# Altium schematic sheet Schematic3.SchDoc
size A4
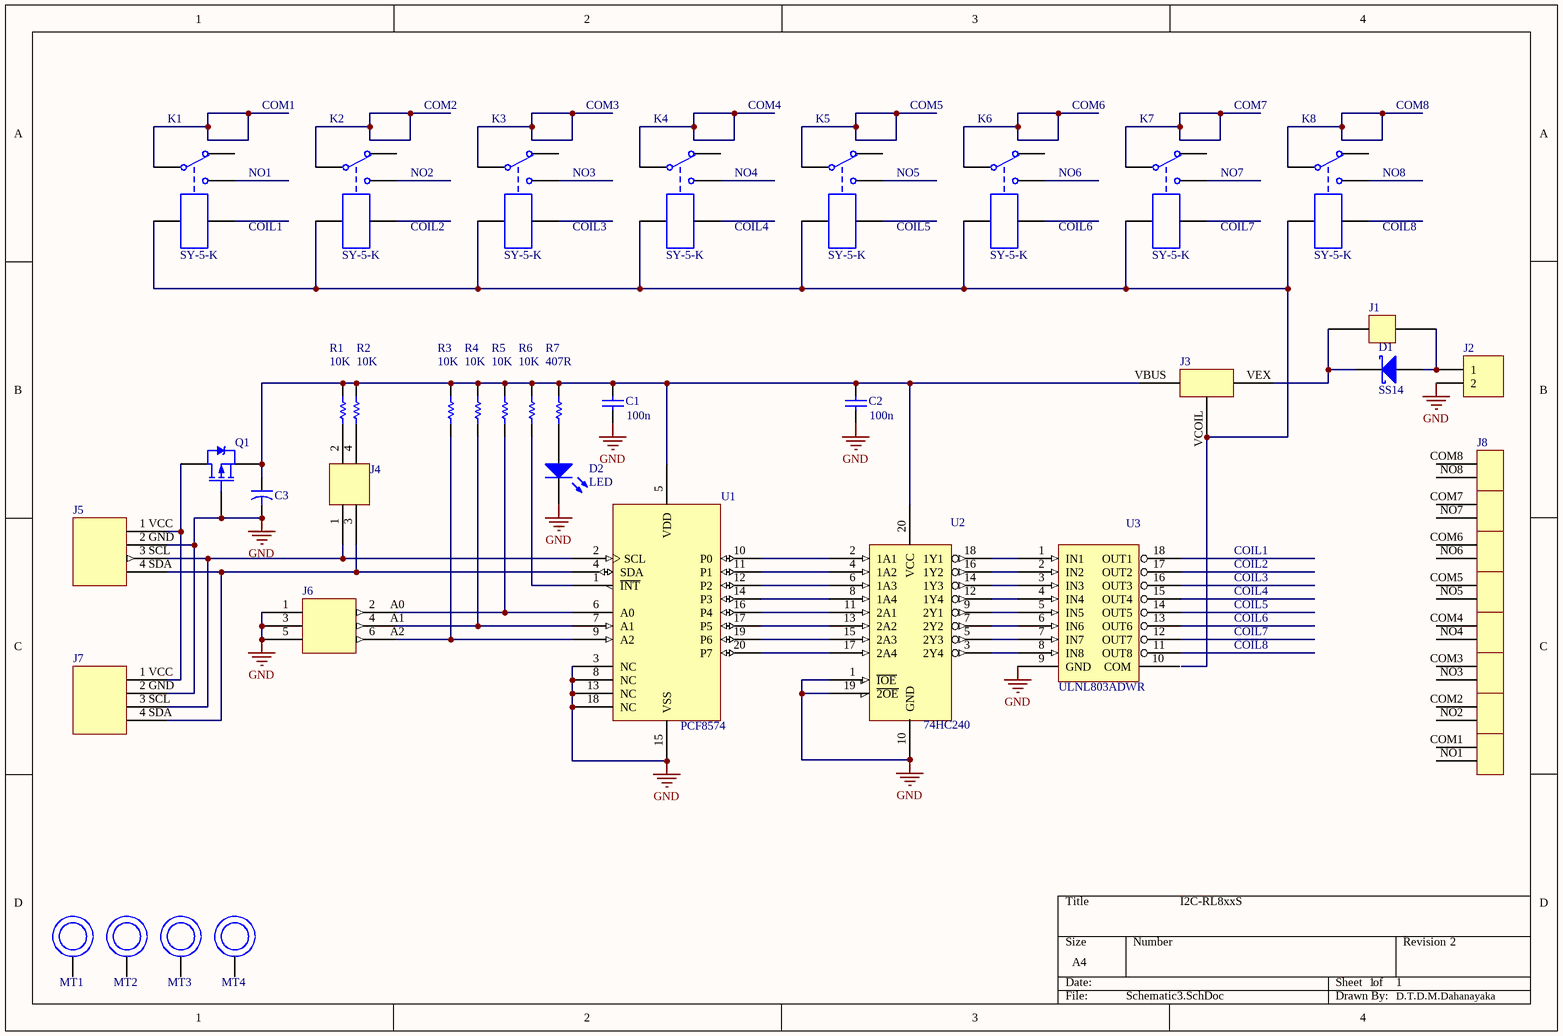
[diagram p0: Schematic3.SchDoc]

## Parts
1  SY-5-K  [MODULE5B]
2  SY-5-K  [MODULE5B]
3  SY-5-K  [MODULE5B]
4  SY-5-K  [MODULE5B]
5  SY-5-K  [MODULE5B]
6  SY-5-K  [MODULE5B]
7  SY-5-K  [MODULE5B]
8  SY-5-K  [MODULE5B]
C1  value 100n  [RAD-0.3]  (hidden comment: Cap)
C2  value 100n  [RAD-0.3]  (hidden comment: Cap)
C3  Cap2  [CAPR5-4X5]  (value not drawn)
D1  SS14  [TO-220AC]
D2  LED  [LED-0]
J1  Component_1  (value not drawn)
J2  (no value)  [HDR1X2]
J3  Component_1  (value not drawn)
J4  Component_1  (value not drawn)
J5  Component_1  (value not drawn)
J6  Component_1  (value not drawn)
J7  Component_1  (value not drawn)
J8  Component_1  (value not drawn)
MT1  Component_1  (value not drawn)
MT2  (no value)
MT3  (no value)
MT4  (no value)
Q1  PMOS-2  [TO-220AB]  (value not drawn)
R1  value 10K  [AXIAL-0.3]
R2  value 10K  [AXIAL-0.3]
R3  value 10K  [AXIAL-0.3]  (hidden comment: Res1)
R4  value 10K  [AXIAL-0.3]  (hidden comment: Res1)
R5  value 10K  [AXIAL-0.3]  (hidden comment: Res1)
R6  value 10K  [AXIAL-0.3]  (hidden comment: Res1)
R7  value 407R  [AXIAL-0.3]  (hidden comment: Res1)
U1  PCF8574
U2  74HC240
U3  ULNL803ADWR

## Nets
GND: C1.1 C2.1 C3.2 D2.2(K) J2.?2(2) J5.2_GND J6.1 J6.3 J6.5 J7.2_GND Q1.1(G) U1.3(NC) U1.8(NC) U1.13(NC) U1.15(VSS) U1.18(NC) U2.1(~{IOE}) U2.10(GND) U2.19(~{2OE}) U3.9(GND)
Net1_4: 1.4 2.4 3.4 4.4 5.4 6.4 7.4 8.4 J3.VCOIL
NetC1_2: C1.2 C2.2 C3.1 J3.VBUS Q1.3(S) R1.2 R2.2 R3.2 R4.2 R5.2 R6.2 R7.2 U1.5(VDD) U2.20(VCC)
NetD1_1: D1.1(K) J1.?1 J3.VEX
NetD1_3: D1.3(A) J1.?2 J2.?1(1)
NetD2_1: D2.1(A) R7.1
NetJ4_1: J4.1 J5.3_SCL J7.3_SCL U1.2(SCL)
NetJ4_3: J4.3 J5.4_SDA J7.4_SDA U1.4(SDA)
NetJ5_1 VCC: J5.1_VCC J7.1_VCC Q1.2(D)
NetJ6_2     A0: J6.2_A0 R5.1 U1.6(A0)
NetJ6_4     A1: J6.4_A1 R4.1 U1.7(A1)
NetJ6_6     A2: J6.6_A2 R3.1 U1.9(A2)
NetR6_1: R6.1 U1.1(~{INT})
NetU1_10: U1.10(P0) U2.2(1A1)
NetU1_11: U1.11(P1) U2.4(1A2)
NetU1_12: U1.12(P2) U2.6(1A3)
NetU1_14: U1.14(P3) U2.8(1A4)
NetU1_16: U1.16(P4) U2.11(2A1)
NetU1_17: U1.17(P5) U2.13(2A2)
NetU1_19: U1.19(P6) U2.15(2A3)
NetU1_20: U1.20(P7) U2.17(2A4)
NetU2_3: U2.3(2Y4) U3.8(IN8)
NetU2_5: U2.5(2Y3) U3.7(IN7)
NetU2_7: U2.7(2Y2) U3.6(IN6)
NetU2_9: U2.9(2Y1) U3.5(IN5)
NetU2_12: U2.12(1Y4) U3.4(IN4)
NetU2_14: U2.14(1Y3) U3.3(IN3)
NetU2_16: U2.16(1Y2) U3.2(IN2)
NetU2_18: U2.18(1Y1) U3.1(IN1)

Not connected (* = marked no-connect by the designer): 1 1 2 3 5; 2 1 2 3 5; 3 1 2 3 5; 4 1 2 3 5; 5 1 2 3 5; 6 1 2 3 5; 7 1 2 3 5; 8 1 2 3 5; J4 2 4; J8 COM1 COM2 COM3 COM4 COM5 COM6 COM7 COM8 NO1 NO2 NO3 NO4 NO5 NO6 NO7 NO8; MT1 ?1; MT2 ?1; MT3 ?1; MT4 ?1; R1 1; R2 1; U3 10(COM) 11(OUT8) 12(OUT7) 13(OUT6) 14(OUT5) 15(OUT4) 16(OUT3) 17(OUT2) 18(OUT1)

## Notes on the sheet
- COM1
- COM2
- COM3
- COM4
- COM5
- COM6
- COM7
- COM8
- (near 1) K1
- (near 1) NO1
- (near 2) K2
- (near 2) NO2
- (near 3) K3
- (near 3) NO3
- (near 4) K4
- (near 4) NO4
- (near 5) K5
- (near 5) NO5
- (near 6) K6
- (near 6) NO6
- (near 7) K7
- (near 7) NO7
- (near 8) K8
- (near 8) NO8
- COIL1
- COIL2
- COIL3
- COIL4
- COIL5
- COIL6
- COIL7
- (near 8) COIL8
- COIL8
- I2C-RL8xxS
- 1
- 2
- D.T.D.M.Dahanayaka

## Library data of the parts
1-8 = Relay-SPDT: Single-Pole Dual-Throw Relay; Published: 24-Mar-1999; LatestRevisionDate: 17-Jul-2002; LatestRevisionNote: Re-released for DXP Platform.; PackageReference: MODULE5B; Publisher: Altium Limited
C1 C2 = Cap: Capacitor; Published: 8-Jun-2000; LatestRevisionDate: 17-Jul-2002; LatestRevisionNote: Re-released for DXP Platform.; PackageReference: RAD-0.3; Publisher: Altium Limited; PackageDescription: Radial Cap, Thru-Hole; 2 Leads; 0.3 in Pin Spacing
C3 = Cap2: Capacitor; Value: 100pF; Published: 23-Sep-2002; PackageReference: CAPR5-4X5; Publisher: Altium Limited; PackageDescription: Capacitor; 2 Leads
D1 = Diode 10TQ035: Schottky Rectifier; Note: Terminal 2 is the TAB and is electrically connected to the cathode; Published: 8-Jun-2000; LatestRevisionDate: 17-Jul-2002; LatestRevisionNote: Re-released for DXP Platform.; DatasheetVersion: PD-2.057B; PackageVersion: Feb-1998; PackageReference: TO-220AC; Publisher: Altium Limited; PackageDescription: TO, Thru-Hole, Vertical, Heatsink Mounted; 3 In-Line Leads (1 Absent); Pitch 2.54 mm; ComponentLink1Description: Manufacturer Link; ComponentLink1URL: http://www.irf.com/; ComponentLink2Description: Datasheet; ComponentLink2URL: http://www.irf.com/product-info/datasheets/data/10tq.pdf
D2 = LED0: Typical INFRARED GaAs LED; Published: 8-Jun-2000; LatestRevisionDate: 08-Jul-2005; LatestRevisionNote: Mech Layer 1 removed.; PackageReference: LED-0; Publisher: Altium Limited; PackageDescription: LED; 2 Leads
J2 = Header 2: Header, 2-Pin; LatestRevisionDate: 17-Jul-2002; LatestRevisionNote: Re-released for DXP Platform.; Publisher: Altium Limited
MT2-MT4 U1-U3 = Component_1
Q1 = PMOS-2: P-Channel Power MOSFET; Note: Pin 4 not drawn and electrically connected to Pin 2.; Published: 8-Jun-2000; LatestRevisionDate: 17-Jul-2002; LatestRevisionNote: Re-released for DXP Platform.; DatasheetVersion: PD-9.390D; PackageVersion: Feb-1997; PackageReference: TO-220AB; Publisher: Altium Limited; PackageDescription: TO, Thru-Hole, Vertical, Heatsink Mounted; 3 In-Line Leads; Pitch 2.54 mm; ComponentLink1Description: Manufacturer Link; ComponentLink1URL: http://www.irf.com/
R1-R7 = Res1: Resistor; Published: 8-Jun-2000; LatestRevisionDate: 17-Jul-2002; LatestRevisionNote: Re-released for DXP Platform.; PackageReference: AXIAL-0.3; Publisher: Altium Limited; PackageDescription: Axial Device, Thru-Hole; 2 Leads; 0.3 in Pin Spacing